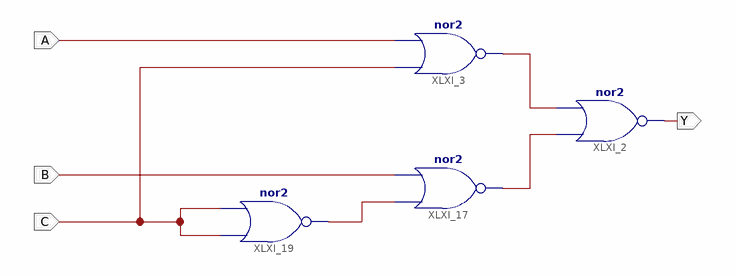
[diagram p0: schematic sheet 1]
// Xilinx ISE schematic SELECTOR.sch (spartan6) as structural Verilog: 4 symbols, 4 ports
module SELECTOR (
  input  C,
  input  B,
  input  A,
  output Y
);

  wire XLXN_24, XLXN_25, XLXN_26;

  nor XLXI_2 (Y, XLXN_25, XLXN_26);
  nor XLXI_3 (XLXN_26, C, A);
  nor XLXI_17 (XLXN_25, XLXN_24, B);
  nor XLXI_19 (XLXN_24, C, C);
endmodule
